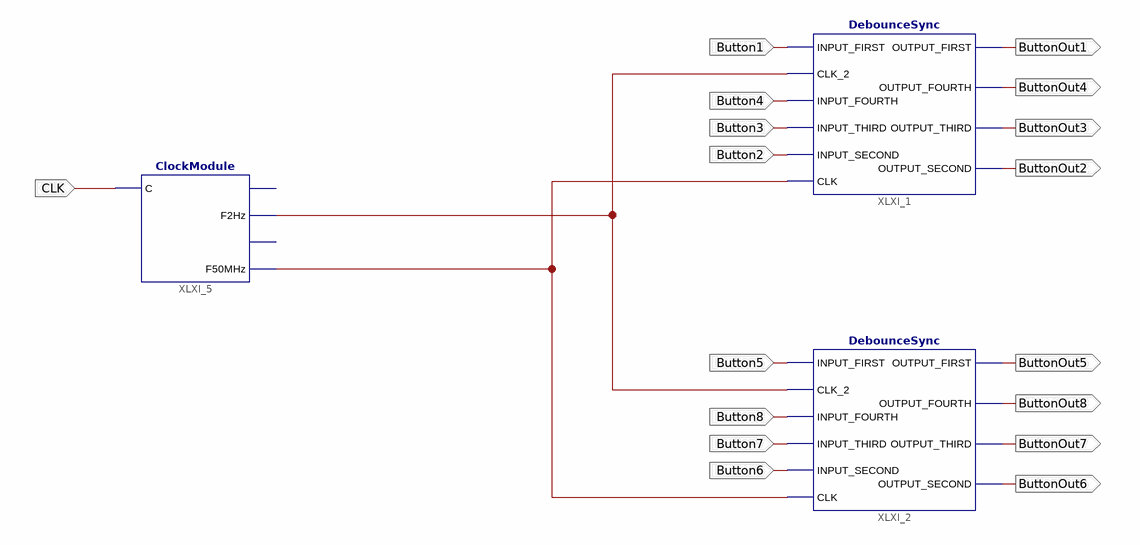
[diagram p0: schematic sheet 1]
// Xilinx ISE schematic ButtonDebouncer.sch (spartan6) as structural Verilog: 3 symbols, 17 ports
module ButtonDebouncer (
  input  CLK,
  input  Button1,
  input  Button4,
  input  Button3,
  input  Button2,
  input  Button5,
  input  Button8,
  input  Button7,
  input  Button6,
  output ButtonOut1,
  output ButtonOut4,
  output ButtonOut3,
  output ButtonOut2,
  output ButtonOut5,
  output ButtonOut8,
  output ButtonOut7,
  output ButtonOut6
);

  wire XLXN_2, XLXN_4;

  ClockModule XLXI_5 (.C(CLK), .F2Hz(XLXN_4), .F50MHz(XLXN_2));  // open: F1Hz, F500Hz
  DebounceSync XLXI_1 (
    .INPUT_FIRST(Button1), .CLK_2(XLXN_4), .INPUT_FOURTH(Button4), .INPUT_THIRD(Button3),
    .INPUT_SECOND(Button2), .CLK(XLXN_2), .OUTPUT_FIRST(ButtonOut1), .OUTPUT_FOURTH(ButtonOut4),
    .OUTPUT_THIRD(ButtonOut3), .OUTPUT_SECOND(ButtonOut2));
  DebounceSync XLXI_2 (
    .INPUT_FIRST(Button5), .CLK_2(XLXN_4), .INPUT_FOURTH(Button8), .INPUT_THIRD(Button7),
    .INPUT_SECOND(Button6), .CLK(XLXN_2), .OUTPUT_FIRST(ButtonOut5), .OUTPUT_FOURTH(ButtonOut8),
    .OUTPUT_THIRD(ButtonOut7), .OUTPUT_SECOND(ButtonOut6));
endmodule
